# EasyEDA schematic Schematic long c.json
TITLE: Hotendboard; REV: 1.2; Date: 2022-01-29; Sheet: 1/1; Drawn By: steven_fragmon; Company: Cryd-Team
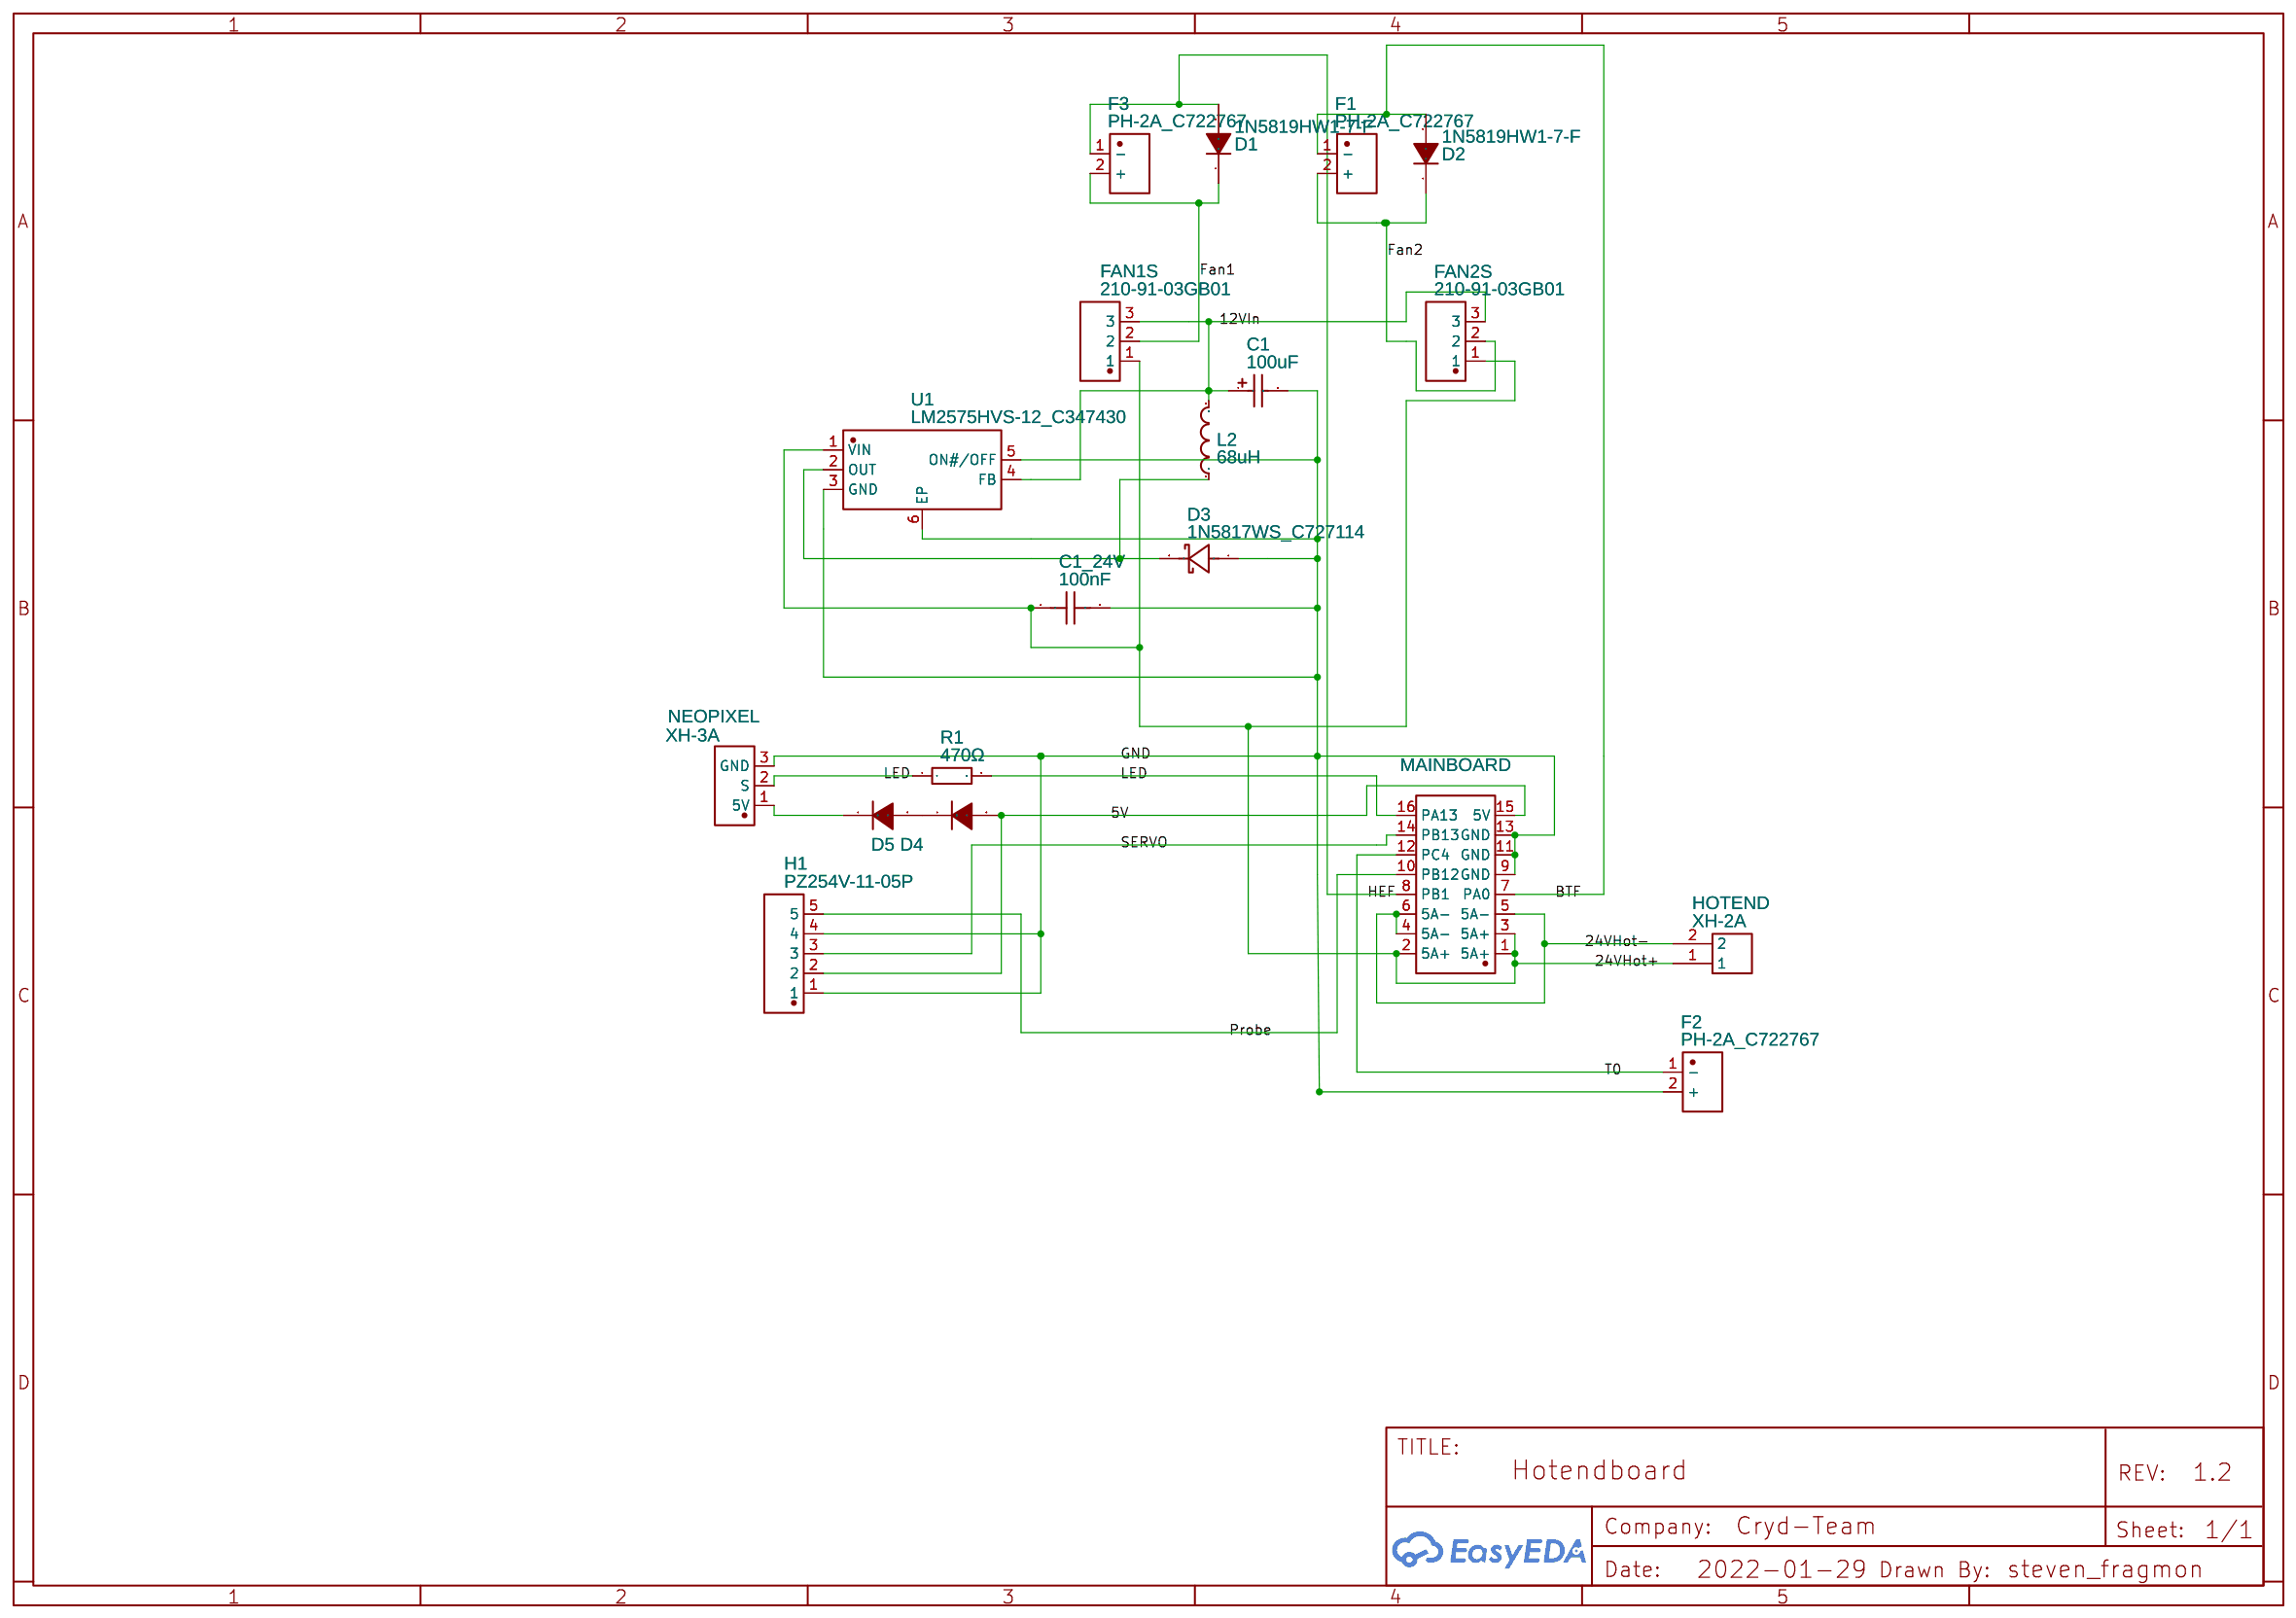
[diagram p0: schematic sheet]

## Parts
C1  100uF  [CAP-SMD_L7.3-W4.3-R-RD]
C1_24V  100nF  [C0603]
D1  1N5819HW1-7-F  [SOD-123F_L2.8-W1.8-LS3.7-RD]
D2  1N5819HW1-7-F  [SOD-123F_L2.8-W1.8-LS3.7-RD]
D3  1N5817WS_C727114  [SOD-323_L1.8-W1.3-LS2.5-FD]
D4  1N4001F  [SMAF_L3.5-W2.6-LS4.7-RD]
D5  1N4001F  [SMAF_L3.5-W2.6-LS4.7-RD]
F1  PH-2A_C722767  [CONN-TH_PH-2A]
F2  PH-2A_C722767  [CONN-TH_PH-2A]
F3  PH-2A_C722767  [CONN-TH_PH-2A]
FAN1S  210-91-03GB01  [HDR-TH_3P-P2.54-V-M]
FAN2S  210-91-03GB01  [HDR-TH_3P-P2.54-V-M]
H1  PZ254V-11-05P  [HDR-TH_5P-P2.54-V-M]
HOTEND  XH-2A  [CONN-TH_XH-2A]
L2  68uH  [IND-SMD_L4.0-W4.0_SMNR4020]
MAINBOARD  IDC-CON-Angled-Latch-16P  [IDC-TH_16P-P2.54_BOOMELE-2X8P-H]
NEOPIXEL  XH-3A  [CONN-TH_C722693]
R1  470Ω  [R0603]
U1  LM2575HVS-12_C347430  [TO-263-5_L10.2-W9.2-P1.70-BR]

## Library data of the parts
C1 = T491D107K016AT: Supplier: LCSC; Manufacturer: KEMET; Contributor: LCSC; Supplier Part: C110548; JLCPCB Part Class: Extended Part
C1_24V = GRM188R71E104KA01D: Supplier: LCSC; Manufacturer: MuRata; Supplier Part: C77050; JLCPCB Part Class: Extended Part
D1 D2 = 1N5819HW1-7-F: Supplier: LCSC; Manufacturer: DIODES; Contributor: LCSC; Supplier Part: C117948; JLCPCB Part Class: Extended Part
D3 = 1N5817WS_C727114: Supplier: LCSC; Supplier Part: C727114; Manufacturer: TWGMC; Manufacturer Part: 1N5817WS; Contributor: LCSC; JLCPCB Part Class: Extended Part
D4 D5 = 1N4001F: Supplier: LCSC; Manufacturer: SK; Supplier Part: C122841; JLCPCB Part Class: Extended Part
F1-F3 = PH-2A_C722767: Supplier: LCSC; Supplier Part: C722767; Manufacturer: CAX; Manufacturer Part: PH-2A; Contributor: LCSC; JLCPCB Part Class: Extended Part
FAN1S FAN2S = 210-91-03GB01: Supplier: LCSC; Supplier Part: C390679; Manufacturer: PINREX; Contributor: LCSC; JLCPCB Part Class: Extended Part
H1 = PZ254V-11-05P: Supplier: LCSC; Supplier Part: C492404; Manufacturer: XFCN; Contributor: LCSC; JLCPCB Part Class: Extended Part
HOTEND = XH-2A: Supplier: LCSC; Manufacturer: BOOMELE; Supplier Part: C20079; JLCPCB Part Class: Extended Part
L2 = SMNR4020-68UH: Supplier: LCSC; Manufacturer: SXN; Supplier Part: C135265; JLCPCB Part Class: Extended Part
MAINBOARD = IDC-CON-Angled-Latch-16P: Supplier: LCSC; Manufacturer: BOOMELE; Supplier Part: C48023; JLCPCB Part Class: Extended Part; Package Display: No
NEOPIXEL = XH-3A_C722863: Supplier: LCSC; Supplier Part: C722863; Manufacturer: CAX; Contributor: LCSC; JLCPCB Part Class: Extended Part
R1 = 0603WAJ0471T5E: Supplier: LCSC; Manufacturer: UniOhm; Supplier Part: C25241; Resistance (Ohms): 470; JLCPCB Part Class: Extended Part
U1 = LM2575HVS-12_C347430: Supplier: LCSC; Supplier Part: C347430; Manufacturer: UMW(友台半导体); Manufacturer Part: LM2575HVS-12; Contributor: LCSC; JLCPCB Part Class: Extended Part

## Nets
5V: D4.2(A) H1.2 MAINBOARD.15(5V)
12VIn: C1.1 FAN1S.3 FAN2S.3 L2.2 U1.4(FB)
24VHot+: C1_24V.1 FAN1S.1 FAN2S.1 HOTEND.1 MAINBOARD.1(5A+) MAINBOARD.2(5A+) MAINBOARD.3(5A+) U1.1(VIN)
24VHot-: HOTEND.2 MAINBOARD.4(5A-) MAINBOARD.5(5A-) MAINBOARD.6(5A-)
GND: C1.2 C1_24V.2 D3.1(A) F2.2(+) H1.1 H1.4 MAINBOARD.9(GND) MAINBOARD.11(GND) MAINBOARD.13(GND) NEOPIXEL.3(GND) U1.3(GND) U1.5(ON#/OFF) U1.6(EP)
BTF: D2.2(A) F1.1(-) MAINBOARD.7(PA0)
Fan1: D1.1(K) F3.2(+) FAN1S.2
Fan2: D2.1(K) F1.2(+) FAN2S.2
HEF: D1.2(A) F3.1(-) MAINBOARD.8(PB1)
LED: MAINBOARD.16(PA13) NEOPIXEL.2(S) R1.1 R1.2
Probe: H1.5 MAINBOARD.10(PB12)
SERVO: H1.3 MAINBOARD.14(PB13)
T0: F2.1(-) MAINBOARD.12(PC4)
Net-(D3-2): D3.2(K) L2.1 U1.2(OUT)
Net-(D4-1): D4.1(C) D5.2(A)
Net-(D5-1): D5.1(C) NEOPIXEL.1(5V)
